# EAGLE design Pi-880Backplane (EAGLE 7.5.0)
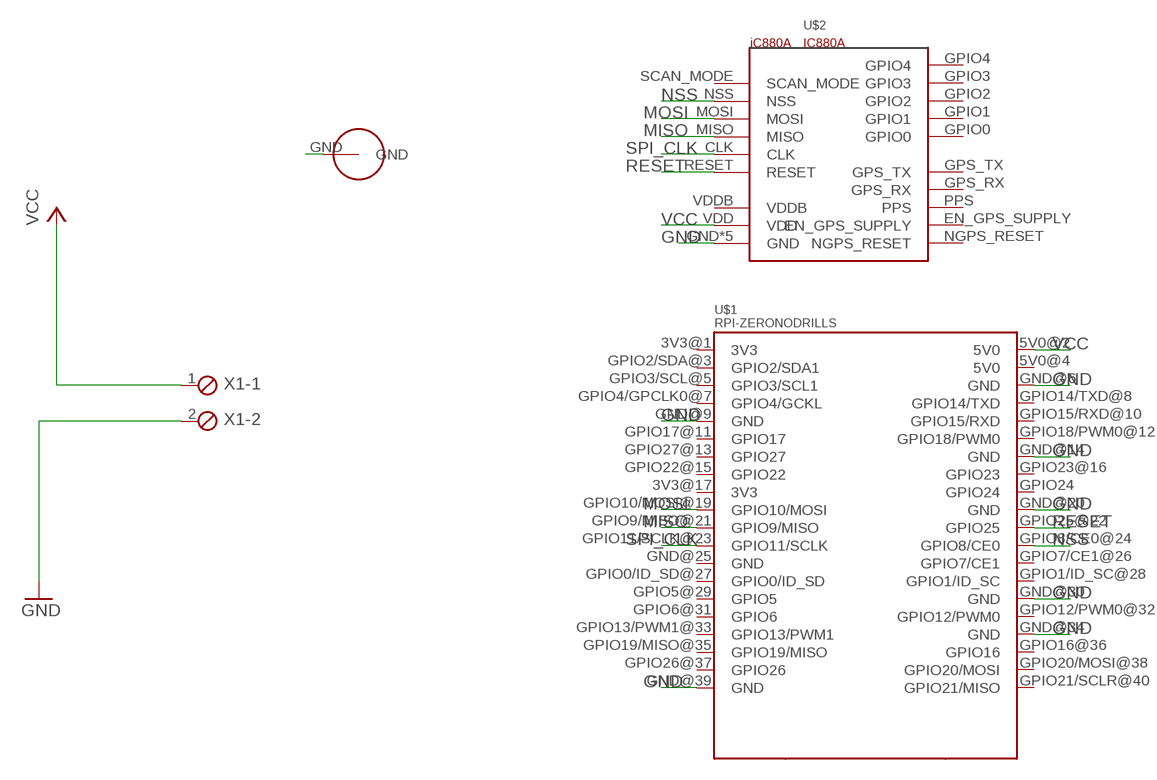
[diagram p0: schematic, sheet 1]

## Parts
U$1  RPI-ZERONODRILLS  [RPI-ZERO-NODRILLS]
U$2  IC880A  [IC880A]
U$3  SMA-PIGTAIL-MOUNT  [SMA-PIGTAIL-MOUNT]
X1  MPT2  [2POL254]

## Nets
GND: U$1.GND@6(GND) U$1.GND@9(GND) U$1.GND@14(GND) U$1.GND@20(GND) U$1.GND@30(GND) U$1.GND@34(GND) U$1.GND@39(GND) U$2.GND U$2.GND2(GND) U$2.GND3(GND) U$2.GND4(GND) U$2.GND5(GND) U$3.GND X1.2
MISO: U$1.GPIO9/MISO@21(GPIO9/MISO) U$2.MISO
MOSI: U$1.GPIO10/MOSI@19(GPIO10/MOSI) U$2.MOSI
NSS: U$1.GPIO8/CE0@24(GPIO8/CE0) U$2.NSS
RESET: U$1.GPIO25@22(GPIO25) U$2.RESET
SPI_CLK: U$1.GPIO11/SCLK@23(GPIO11/SCLK) U$2.CLK
VCC: U$1.5V0@2(5V0) U$2.VDD X1.1
Unconnected: U$1.3V3@1(3V3) U$1.3V3@17(3V3) U$1.5V0@4(5V0) U$1.GND@25(GND) U$1.GPIO0/ID_SD@27(GPIO0/ID_SD) U$1.GPIO1/ID_SC@28(GPIO1/ID_SC) U$1.GPIO2/SDA@3(GPIO2/SDA1) U$1.GPIO3/SCL@5(GPIO3/SCL1) U$1.GPIO4/GPCLK0@7(GPIO4/GCKL) U$1.GPIO5@29(GPIO5) U$1.GPIO6@31(GPIO6) U$1.GPIO7/CE1@26(GPIO7/CE1) U$1.GPIO12/PWM0@32(GPIO12/PWM0) U$1.GPIO13/PWM1@33(GPIO13/PWM1) U$1.GPIO14/TXD@8(GPIO14/TXD) U$1.GPIO15/RXD@10(GPIO15/RXD) U$1.GPIO16@36(GPIO16) U$1.GPIO17@11(GPIO17) U$1.GPIO18/PWM0@12(GPIO18/PWM0) U$1.GPIO19/MISO@35(GPIO19/MISO) U$1.GPIO20/MOSI@38(GPIO20/MOSI) U$1.GPIO21/SCLR@40(GPIO21/MISO) U$1.GPIO22@15(GPIO22) U$1.GPIO23@16(GPIO23) U$1.GPIO24 U$1.GPIO26@37(GPIO26) U$1.GPIO27@13(GPIO27) U$2.EN_GPS_SUPPLY U$2.GPIO0 U$2.GPIO1 U$2.GPIO2 U$2.GPIO3 U$2.GPIO4 U$2.GPS_RX U$2.GPS_TX U$2.NGPS_RESET U$2.PPS U$2.SCAN_MODE U$2.VDDB

## Library data of the parts
U$1 = tobias:RPI-ZERO
U$2 = tobias:IC880A: iC880A - LoRaWAN Concentrator 868MHz NOT TESTED Info: http://www.wireless-solutions.de/products/long-range-radio/ic880a Datasheet: http://www.wireless-solutions.de/images/stories/downloads/Radio%20Modules/iC880A/iC880A_Datasheet_V0_15.pdf
U$3 = tobias:SMA-PIGTAIL-MOUNT
X1 = con-phoenix-254:MPT2: PHOENIX CONNECTOR; OC_FARNELL: unknown; OC_NEWARK: unknown

## Board
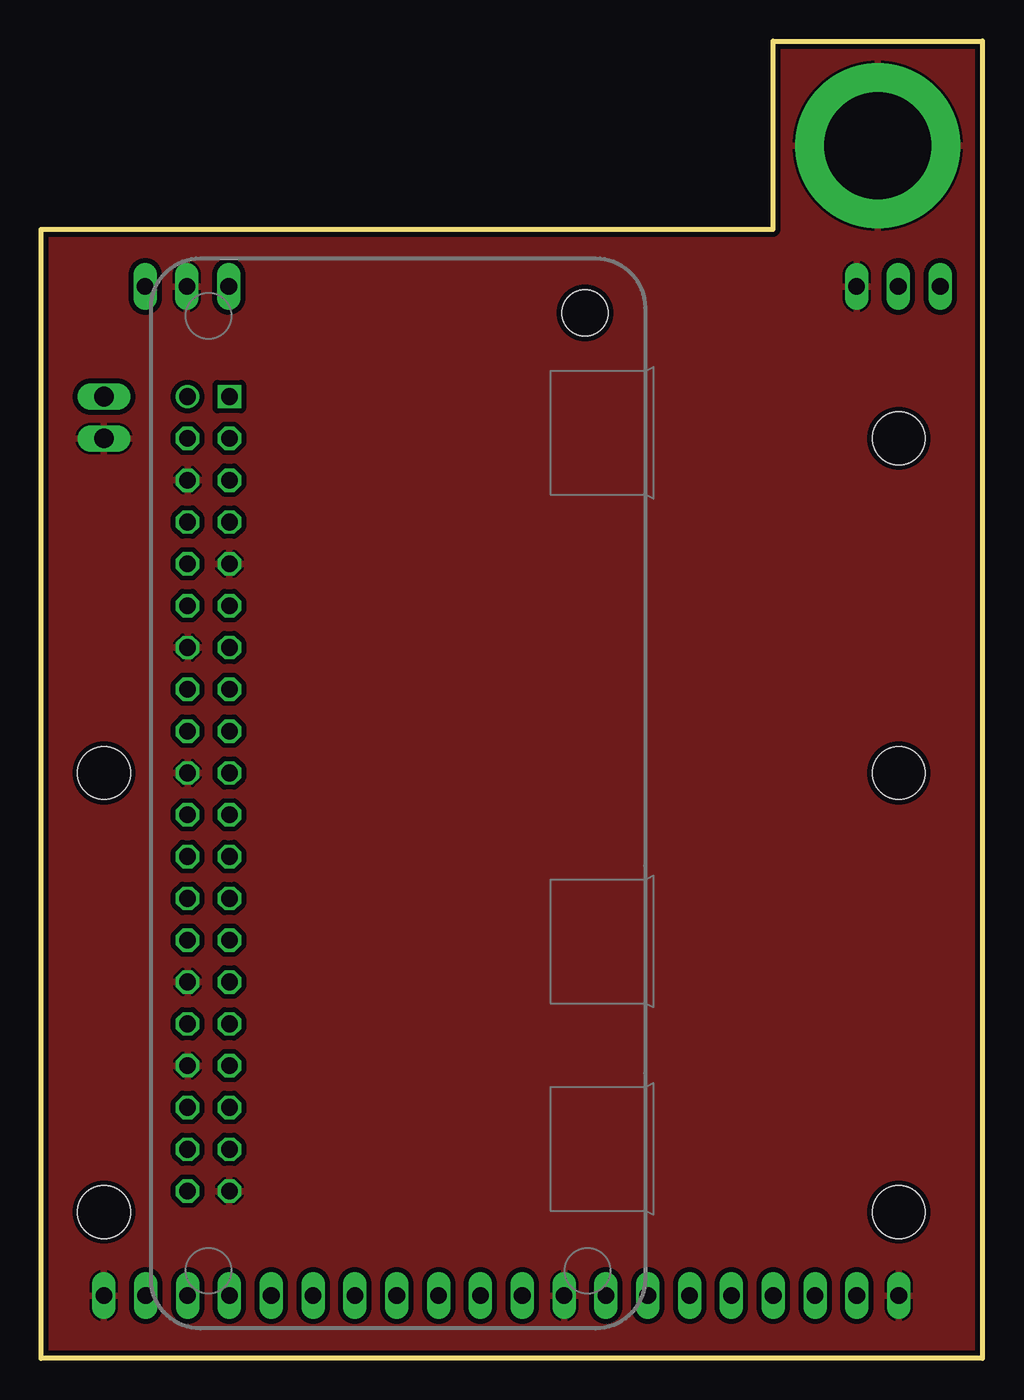
[diagram p1: board, top side]
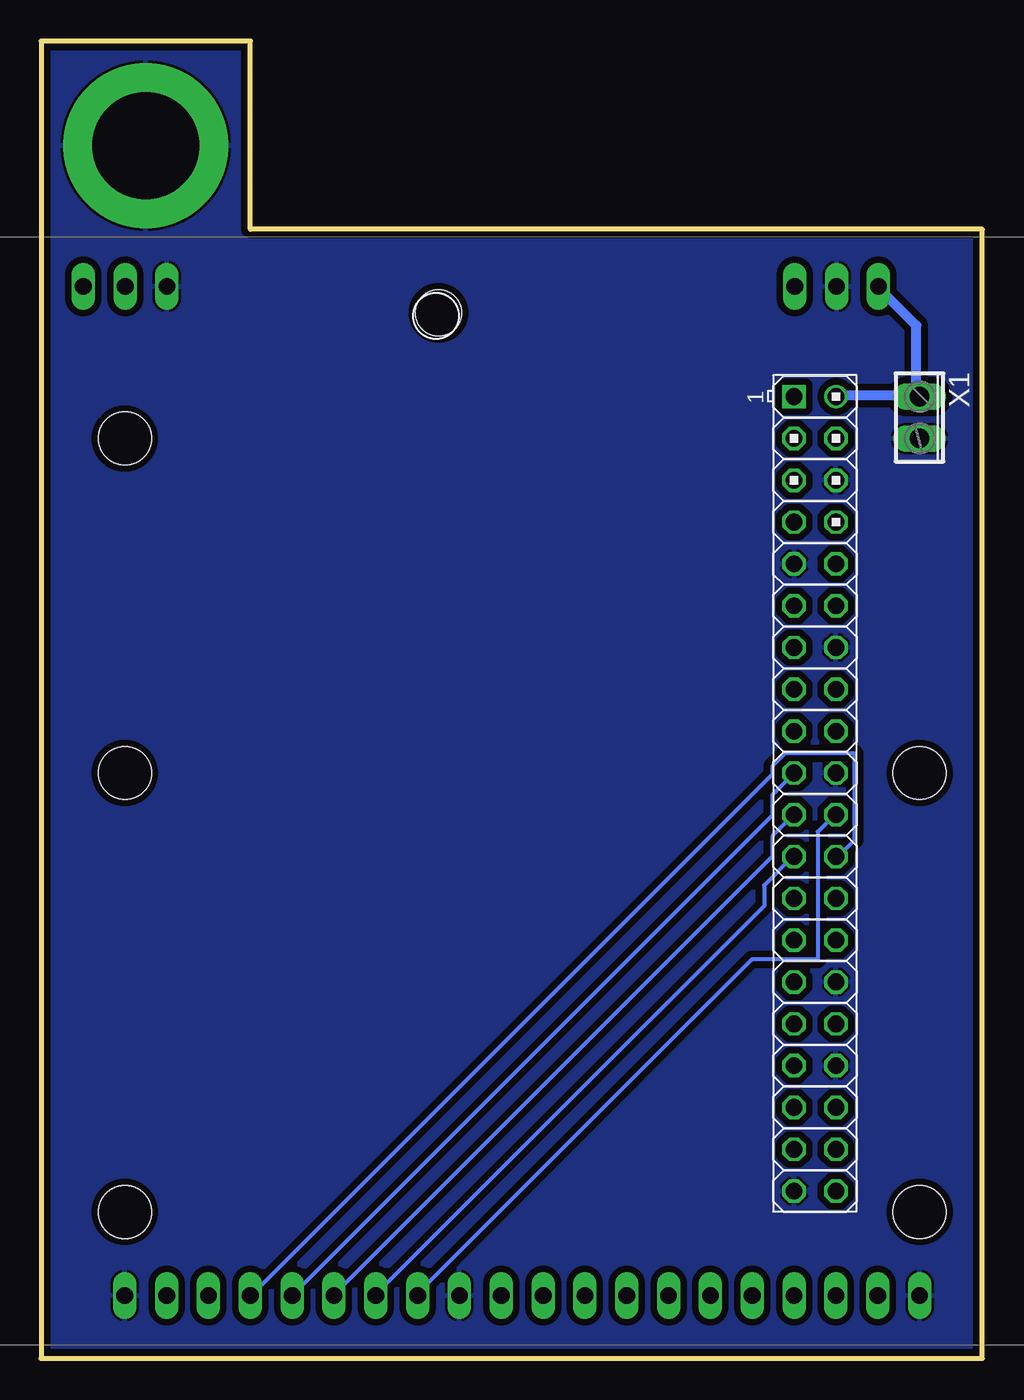
[diagram p2: board, bottom side, seen from below]

Size 57.15 x 80.01 mm. Coordinates in mm from the lower left corner, seen from the top.
Outline: 0,0 0,68.58 44.45,68.58 44.45,80.01 57.15,80.01 57.15,0 0,0
Copper layers (1*16): Top 0.035mm / dielectric 1.5mm / Bottom 0.035mm
Design rules "Fischer-LP_BGA": minimum track width 0.15mm, minimum drill 0.3mm, track to track 0.15mm, track to pad 0.15mm, pad to pad 0.15mm, via to via 0.15mm, smd to smd 0mil, copper to edge 0.2mm, drill to drill 0.3mm, minimum pad ring 0.2mm, minimum via ring 0.15mm, stop-mask expansion 0.05mm, vias tented up to drill 0.5mm, thermal gap 0.15mm
Holes 3.2 mm at 52.07,55.88 52.07,8.89 3.81,8.89 3.81,35.56 52.07,35.56
Holes 2.8 mm at 33.02,63.5
Milling: 6 lines

### Footprints (pad centres in the part's own frame; a part is rotated, then mirrored left to right if it is on the bottom)
RPI-ZERO-NODRILLS = drill 1.016 square: 3V3@1 8.89,25.4 | drill 1.016 octagon: 3V3@17 29.21,25.4; 5V0@4 11.43,27.94; GND@6 13.97,27.94; GND@9 19.05,25.4; GND@14 24.13,27.94; GND@20 31.75,27.94; GND@25 39.37,25.4; GND@30 44.45,27.94; GND@34 49.53,27.94; GND@39 57.15,25.4; GPIO0/ID_SD@27 41.91,25.4; GPIO1/ID_SC@28 41.91,27.94; GPIO2/SDA@3 11.43,25.4; GPIO3/SCL@5 13.97,25.4; GPIO4/GPCLK0@7 16.51,25.4; GPIO5@29 44.45,25.4; GPIO6@31 46.99,25.4; GPIO7/CE1@26 39.37,27.94; GPIO8/CE0@24 36.83,27.94; GPIO9/MISO@21 34.29,25.4; GPIO10/MOSI@19 31.75,25.4; GPIO11/SCLK@23 36.83,25.4; GPIO12/PWM0@32 46.99,27.94; GPIO13/PWM1@33 49.53,25.4; GPIO14/TXD@8 16.51,27.94; GPIO15/RXD@10 19.05,27.94; GPIO16@36 52.07,27.94; GPIO17@11 21.59,25.4; GPIO18/PWM0@12 21.59,27.94; GPIO19/MISO@35 52.07,25.4; GPIO20/MOSI@38 54.61,27.94; GPIO21/SCLR@40 57.15,27.94; GPIO22@15 26.67,25.4; GPIO23@16 26.67,27.94; GPIO24 29.21,27.94; GPIO25@22 34.29,27.94; GPIO26@37 54.61,25.4; GPIO27@13 24.13,25.4 | drill 1.016: 5V0@2 8.89,27.94
IC880A = drill 1.016 long: CLK 49.53,3.81; EN_GPS_SUPPLY 26.67,3.81; GND 16.51,3.81; GND2 44.45,3.81; GND3 64.77,3.81; GND4 21.55,65.11; GND5 62.21,65.11; GPIO0 31.75,3.81; GPIO1 34.29,3.81; GPIO2 36.83,3.81; GPIO3 39.37,3.81; GPIO4 41.91,3.81; GPS_RX 67.29,65.11; GPS_TX 64.75,65.11; MISO 52.07,3.81; MOSI 54.61,3.81; NGPS_RESET 21.59,3.81; NSS 57.15,3.81; P$2 19.05,3.81; P$4 24.13,3.81; P$6 29.21,3.81; PPS 62.23,3.81; RESET 46.99,3.81; SCAN_MODE 59.69,3.81; VDD 19.01,65.11; VDDB 24.09,65.11
SMA-PIGTAIL-MOUNT = drill 6.5 pad 10: GND 0,0
2POL254 = drill 1.2 long: 1 -1.27,0; 2 1.27,0

### Placement (x,y rotation side)
U$1  36.83,67.31 270 bottom
U$2  -12.7,0 0 top
U$3  50.8,73.66 0 top
X1  3.81,57.15 270 bottom

### Tracks (layer width: path | path; a pad name or v marks a point on that pad's centre or on a via)
GND
  pour Bottom (isolate 0.406): 0,0 57.15,0 57.15,80.01 44.45,80.01 44.45,68.58 0,68.58
  pour Top (isolate 0.305): 0,68.58 44.45,68.58 44.45,80.01 57.15,80.01 57.15,0 0,0
MISO
  Bottom 0.254: U$2.MISO 39.25,3.98 12.75,30.48 12.75,31.73 11.5,32.98 U$1.GPIO9/MISO@21
MOSI
  Bottom 0.254: U$2.MOSI 41.75,3.98 12.75,32.98 12.75,34.23 11.5,35.48 U$1.GPIO10/MOSI@19
NSS
  Bottom 0.254: U$2.NSS 44.25,3.98 12.75,35.48 12.75,35.98 12,36.73 7.75,36.73 7.75,31.48 8.75,30.48 U$1.GPIO8/CE0@24
RESET
  Bottom 0.254: U$2.RESET 34.25,3.98 14,24.23 10,24.23 10,31.98 9,32.98 U$1.GPIO25@22
SPI_CLK
  Bottom 0.254: U$2.CLK 36.75,3.98 13.25,27.48 13.25,28.73 11.5,30.48 U$1.GPIO11/SCLK@23
VCC
  Bottom 0.254: 6.25,64.98 U$2.VDD
  Bottom 0.61: 6.25,64.98 4,62.73 4,58.48 | 4,58.48 8.75,58.48 U$1.5V0@2 | 4,58.48 X1.1